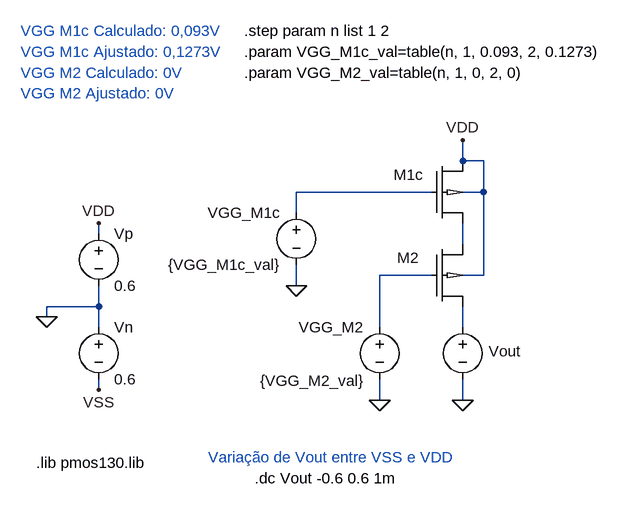
[diagram p0: schematic FiguraB_Questao2.asc]
FiguraB_Questao2.asc, the LTspice schematic file:
Version 4.1
SHEET 1 968 680
WIRE 416 -272 416 -304
WIRE 448 -272 416 -272
WIRE 368 -224 160 -224
WIRE 448 -224 448 -272
WIRE 448 -224 416 -224
WIRE 160 -192 160 -224
WIRE -144 -160 -144 -176
WIRE 416 -144 416 -176
WIRE 368 -96 288 -96
WIRE 448 -96 448 -224
WIRE 448 -96 416 -96
WIRE 160 -80 160 -112
WIRE -144 -48 -144 -80
WIRE -144 -48 -224 -48
WIRE -224 -32 -224 -48
WIRE -144 -16 -144 -48
WIRE 288 -16 288 -96
WIRE 416 -16 416 -48
WIRE -144 80 -144 64
WIRE 288 96 288 64
WIRE 416 96 416 64
FLAG -224 -32 0
FLAG -144 80 VSS
FLAG -144 -176 VDD
FLAG 416 -304 VDD
FLAG 288 96 0
FLAG 416 96 0
FLAG 160 -80 0
SYMBOL pmos130 368 -144 R0
WINDOW 0 -53 21 Left 2
WINDOW 3 -99 27 Invisible 2
SYMATTR InstName M2
SYMATTR SpiceLine width=13460n length=400n
SYMBOL voltage -144 -176 R0
WINDOW 123 0 0 Left 0
WINDOW 39 0 0 Left 0
SYMATTR InstName Vp
SYMATTR Value 0.6
SYMBOL voltage -144 -32 R0
WINDOW 123 0 0 Left 0
WINDOW 39 0 0 Left 0
SYMATTR InstName Vn
SYMATTR Value 0.6
SYMBOL voltage 288 -32 M0
WINDOW 3 22 98 Left 2
SYMATTR Value {VGG_M2_val}
SYMATTR InstName VGG_M2
SYMBOL voltage 416 -32 R0
WINDOW 0 40 53 Left 2
WINDOW 3 24 96 Invisible 2
WINDOW 123 0 0 Left 0
WINDOW 39 0 0 Left 0
SYMATTR InstName Vout
SYMATTR Value 0.6
SYMBOL pmos130 368 -272 R0
WINDOW 0 -58 21 Left 2
WINDOW 3 56 72 Invisible 2
SYMATTR InstName M1c
SYMATTR SpiceLine width=6463n length=400n
SYMBOL voltage 160 -208 M0
SYMATTR InstName VGG_M1c
SYMATTR Value {VGG_M1c_val}
TEXT -240 192 Left 2 !.lib pmos130.lib
TEXT 96 216 Left 2 !.dc Vout -0.6 0.6 1m
TEXT -264 -472 Left 2 ;VGG M1c Calculado: 0,093V
TEXT -264 -440 Left 2 ;VGG M1c Ajustado: 0,1273V
TEXT 24 184 Left 2 ;Variação de Vout entre VSS e VDD
TEXT 80 -440 Left 2 !.param VGG_M1c_val=table(n, 1, 0.093, 2, 0.1273)
TEXT 80 -472 Left 2 !.step param n list 1 2
TEXT 80 -408 Left 2 !.param VGG_M2_val=table(n, 1, 0, 2, 0)
TEXT -264 -408 Left 2 ;VGG M2 Calculado: 0V
TEXT -264 -376 Left 2 ;VGG M2 Ajustado: 0V

The netlist it stands for:
* FiguraB_Questao2.asc
X§M2 N002 N003 N004 VDD pmos130 width=13460n length=400n  ; pins D G S B
Vp VDD 0 0.6
Vn 0 VSS 0.6
VGG_M2 N003 0 {VGG_M2_val}
Vout N004 0 0.6
X§M1c VDD N001 N002 VDD pmos130 width=6463n length=400n  ; pins D G S B
VGG_M1c N001 0 {VGG_M1c_val}
.lib pmos130.lib
.dc Vout -0.6 0.6 1m
* VGG M1c Calculado: 0,093V
* VGG M1c Ajustado: 0,1273V
* Variação de Vout entre VSS e VDD
.param VGG_M1c_val=table(n, 1, 0.093, 2, 0.1273)
.step param n list 1 2
.param VGG_M2_val=table(n, 1, 0, 2, 0)
* VGG M2 Calculado: 0V
* VGG M2 Ajustado: 0V
.backanno
.end